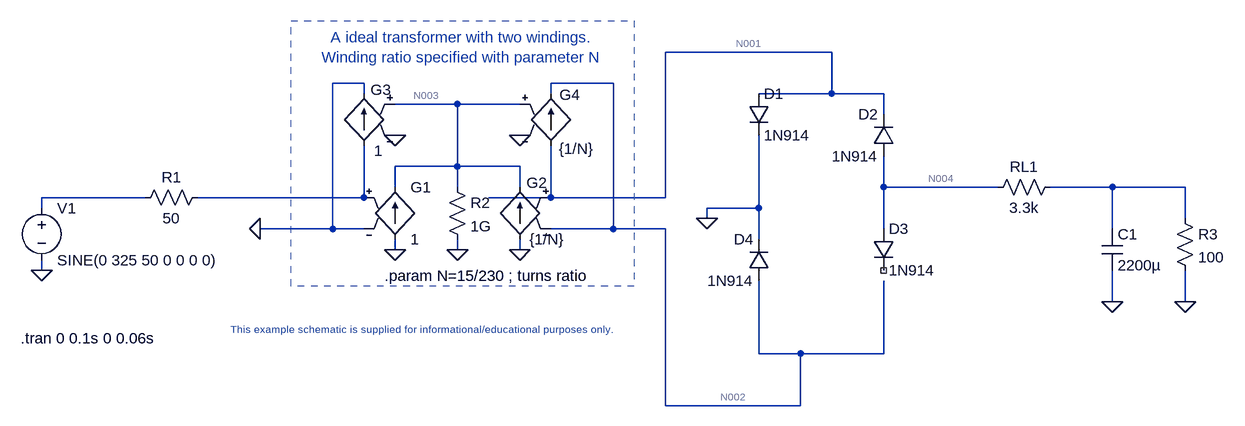
[diagram p0: schematic shunt_filter_2withRectifier.asc]
shunt_filter_2withRectifier.asc, the LTspice schematic file:
Version 4
SHEET 1 1300 680
WIRE 688 -48 432 -48
WIRE -32 0 -80 0
WIRE 352 0 256 0
WIRE -32 16 -32 0
WIRE 256 16 256 0
WIRE 688 16 688 -48
WIRE 688 16 576 16
WIRE 768 16 688 16
WIRE 112 32 16 32
WIRE 208 32 112 32
WIRE 768 48 768 16
WIRE 112 128 112 32
WIRE 112 128 16 128
WIRE 208 128 112 128
WIRE 16 160 16 128
WIRE 112 160 112 128
WIRE 208 160 208 128
WIRE 768 160 768 112
WIRE 944 160 768 160
WIRE 1120 160 1024 160
WIRE 1232 160 1120 160
WIRE -368 176 -528 176
WIRE -32 176 -32 96
WIRE -32 176 -288 176
WIRE 256 176 256 96
WIRE 256 176 160 176
WIRE 432 176 432 -48
WIRE 432 176 256 176
WIRE -528 192 -528 176
WIRE 576 192 576 80
WIRE 576 192 496 192
WIRE 496 208 496 192
WIRE 1232 208 1232 160
WIRE -80 224 -80 0
WIRE -80 224 -192 224
WIRE -32 224 -80 224
WIRE 352 224 352 0
WIRE 352 224 256 224
WIRE 432 224 352 224
WIRE 768 224 768 160
WIRE 1120 224 1120 160
WIRE 576 240 576 192
WIRE 16 256 16 240
WIRE 112 256 112 240
WIRE 208 256 208 240
WIRE -528 288 -528 272
WIRE 1120 336 1120 288
WIRE 1232 336 1232 288
WIRE 576 416 576 304
WIRE 640 416 576 416
WIRE 768 416 768 304
WIRE 768 416 640 416
WIRE 432 496 432 224
WIRE 640 496 640 416
WIRE 640 496 432 496
FLAG -528 288 0
FLAG 208 256 0
FLAG 16 256 0
FLAG 16 80 0
FLAG 208 80 0
FLAG 112 256 0
FLAG -192 224 0
FLAG 496 208 0
FLAG 1120 336 0
FLAG 1232 336 0
SYMBOL voltage -528 176 R0
WINDOW 123 0 0 Left 0
WINDOW 39 0 0 Left 0
SYMATTR InstName V1
SYMATTR Value SINE(0 325 50 0 0 0 0)
SYMBOL res -272 160 R90
WINDOW 0 0 56 VBottom 2
WINDOW 3 32 56 VTop 2
SYMATTR InstName R1
SYMATTR Value 50
SYMBOL g 16 144 R0
SYMATTR InstName G1
SYMATTR Value 1
SYMBOL g 208 144 M0
WINDOW 0 -10 9 Right 2
WINDOW 3 -15 96 Right 2
SYMATTR InstName G2
SYMATTR Value {1/N}
SYMBOL g -32 0 M0
WINDOW 0 -10 10 Right 2
WINDOW 3 -16 104 Right 2
SYMATTR InstName G3
SYMATTR Value 1
SYMBOL g 256 0 R0
WINDOW 0 13 18 Left 2
WINDOW 3 12 101 Left 2
SYMATTR InstName G4
SYMATTR Value {1/N}
SYMBOL res 96 144 R0
SYMATTR InstName R2
SYMATTR Value 1G
SYMBOL diode 560 16 R0
SYMATTR InstName D1
SYMATTR Value 1N914
SYMBOL diode 784 112 R180
WINDOW 0 24 64 Left 2
WINDOW 3 24 0 Left 2
SYMATTR InstName D2
SYMATTR Value 1N914
SYMBOL diode 752 224 R0
SYMATTR InstName D3
SYMATTR Value 1N914
SYMBOL diode 592 304 R180
WINDOW 0 24 64 Left 2
WINDOW 3 24 0 Left 2
SYMATTR InstName D4
SYMATTR Value 1N914
SYMBOL res 928 176 R270
WINDOW 0 32 56 VTop 2
WINDOW 3 0 56 VBottom 2
SYMATTR InstName RL1
SYMATTR Value 3.3k
SYMBOL cap 1104 224 R0
SYMATTR InstName C1
SYMATTR Value 2200µ
SYMBOL res 1216 192 R0
SYMATTR InstName R3
SYMATTR Value 100
TEXT 48 368 Top 1 ;This example schematic is supplied for informational/educational purposes only.
TEXT 120 -24 Bottom 2 ;A ideal transformer with two windings.\nWinding ratio specified with parameter N
TEXT 0 296 Left 2 !.param N=15/230 ; turns ratio
TEXT -560 392 Left 2 !.tran 0 0.1s 0 0.06s
RECTANGLE Normal 384 312 -144 -96 2

The netlist it stands for:
* shunt_filter_2withRectifier.asc
V1 N006 0 SINE(0 325 50 0 0 0 0)
R1 N007 N006 50
G1 0 N003 N007 0 1
G2 0 N003 N001 N002 {1/N}
G3 N007 0 N003 0 1
G4 N001 N002 N003 0 {1/N}
R2 N003 0 1G
D1 N001 0 1N914
D2 N004 N001 1N914
D3 N004 NC_01 1N914
D4 N002 0 1N914
RL1 N004 N005 3.3k
C1 N005 0 2200µ
R3 N005 0 100
.model D D
.lib standard.dio
* This example schematic is supplied for informational/educational purposes only.
* A ideal transformer with two windings.
* Winding ratio specified with parameter N
.param N=15/230 ; turns ratio
.tran 0 0.1s 0 0.06s
.backanno
.end

* Results of the author's LTspice run, read from the files saved beside the schematic
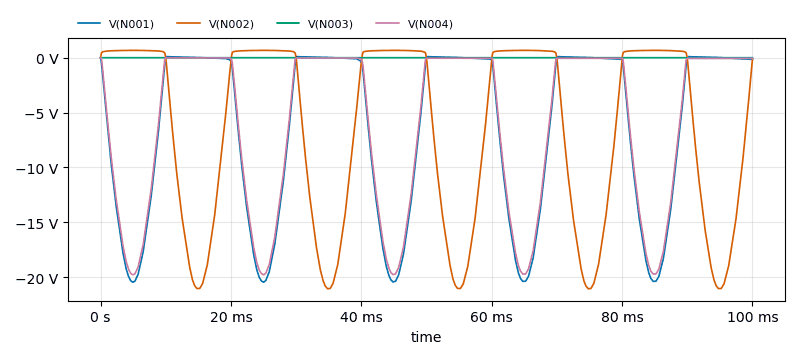
[diagram p1: Transient Analysis of shunt_filter_2withRectifier.asc, plotted from the saved traces]
* Transient Analysis, 1 run:
*   V(N001): min -20.47 V, max 102.1 mV, average -6.303 V, rms 10.05 V, last -158.2 mV
*   V(N002): min -21.07 V, max 668.8 mV, average -6.287 V, rms 10.46 V, last -158.2 mV
*   V(N003): min -1.573 nV, max 391.1 µV, average 118 µV, rms 190.1 µV, last 1.203 nV
*   V(N004): min -19.8 V, max 0 V, average -6.012 V, rms 9.641 V, last -65.61 mV